# Altium schematic sheet Karduino_Sch.schdoc
size 287 x 176 mm
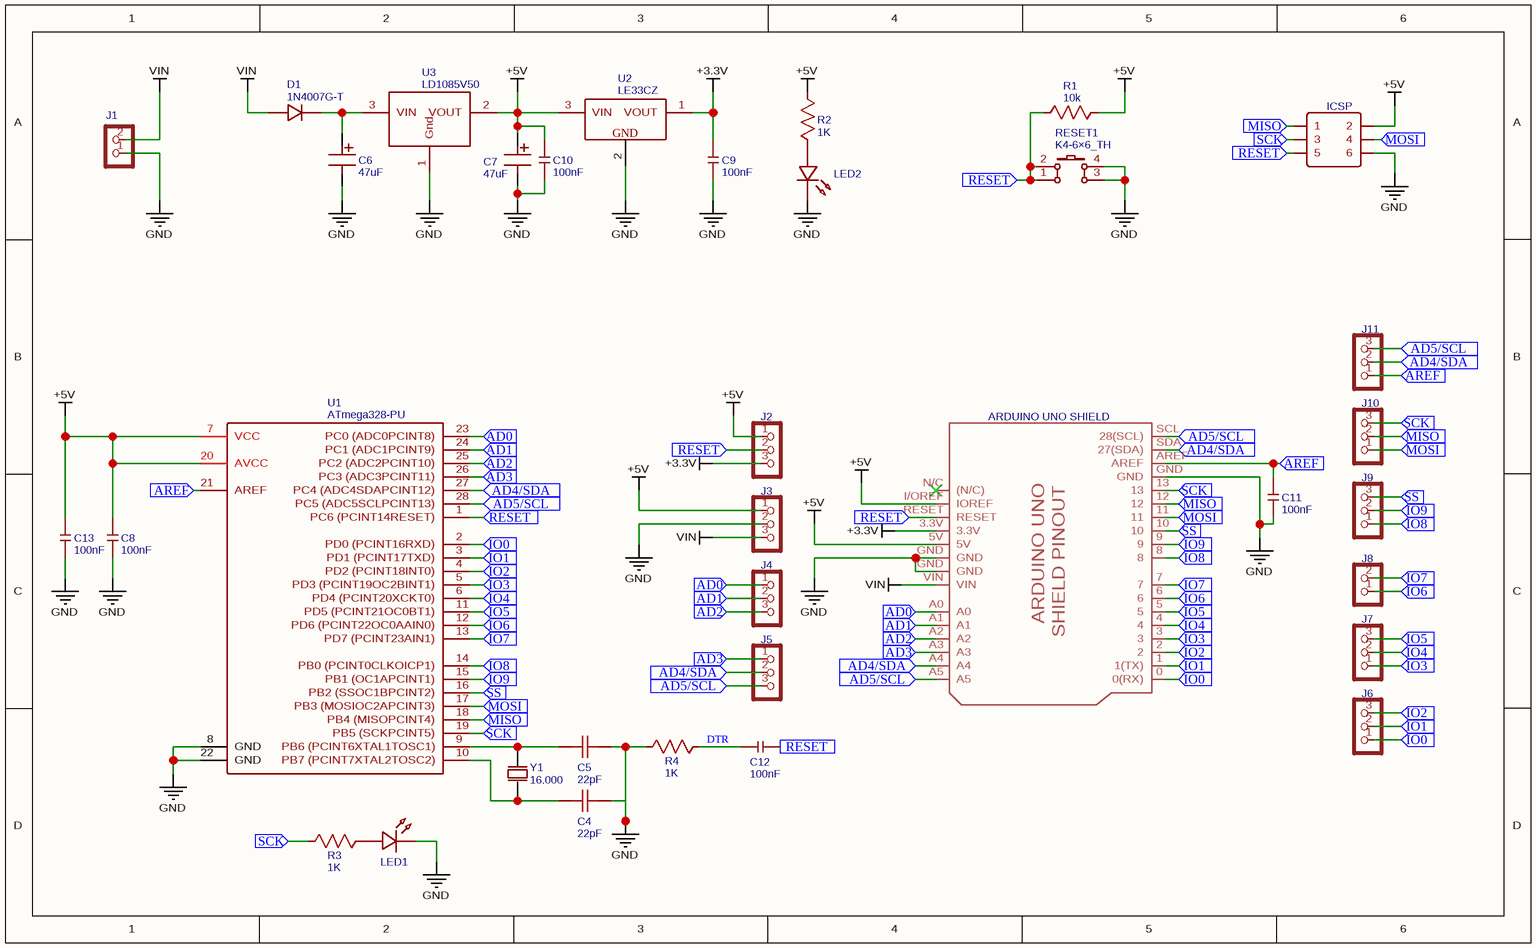
[diagram p0: Karduino_Sch.schdoc]

## Parts
C4  22pF  [CAP-TH_L4.8-W3.2-P5.08-D0.5]
C5  22pF  [CAP-TH_L4.8-W3.2-P5.08-D0.5]
C6  47uF  [PKG-ELE-CAP-D5.0XH11.0XF2.0-VERT]
C7  47uF  [PKG-ELE-CAP-D5.0XH11.0XF2.0-VERT]
C8  100nF  [100NF, 63V CAPACITOR]
C9  100nF  [100NF, 63V CAPACITOR]
C10  100nF  [100NF, 63V CAPACITOR]
C11  100nF  [100NF, 63V CAPACITOR]
C12  100nF  [100NF, 63V CAPACITOR]
C13  100nF  [100NF, 63V CAPACITOR]
D1  1N4007G-T  [DO-41_BD2.4-L4.7-P8.70-D0.9-RD]
ICSP  ICSP  [HDR-TH_6P-P2.54-V-M-R2-C3-S2.54-1]  (value not drawn)
J1  CON_TERMINAL_BLOCK_02-5MM  [TERMINAL_BLOCK_2P_5]  (value not drawn)
J2  CON_TERMINAL_BLOCK_03-5MM  [TERMINAL_BLOCK_3P_5]  (value not drawn)
J3  CON_TERMINAL_BLOCK_03-5MM  [TERMINAL_BLOCK_3P_5]  (value not drawn)
J4  CON_TERMINAL_BLOCK_03-5MM  [TERMINAL_BLOCK_3P_5]  (value not drawn)
J5  CON_TERMINAL_BLOCK_03-5MM  [TERMINAL_BLOCK_3P_5]  (value not drawn)
J6  CON_TERMINAL_BLOCK_03-5MM  [TERMINAL_BLOCK_3P_5]  (value not drawn)
J7  CON_TERMINAL_BLOCK_03-5MM  [TERMINAL_BLOCK_3P_5]  (value not drawn)
J8  CON_TERMINAL_BLOCK_02-5MM  [TERMINAL_BLOCK_2P_5]  (value not drawn)
J9  CON_TERMINAL_BLOCK_03-5MM  [TERMINAL_BLOCK_3P_5]  (value not drawn)
J10  CON_TERMINAL_BLOCK_03-5MM  [TERMINAL_BLOCK_3P_5]  (value not drawn)
J11  CON_TERMINAL_BLOCK_03-5MM  [TERMINAL_BLOCK_3P_5]  (value not drawn)
LED1  LED-TH-3mm_G  [LED-TH_BD3.0_GREEN]  (value not drawn)
LED2  LED-TH-3mm_R  [LED-TH_BD3.0_RED]  (value not drawn)
PCB1  ARDUINO UNO SHIELD  [E14_ARDUINO_SHIELD_PINOUT]
R1  10k  [R_AXIAL-0.3]
R2  1K  [R_AXIAL-0.3]
R3  1K  [R_AXIAL-0.3]
R4  1K  [R_AXIAL-0.3]
RESET1  K4-6×6_TH  [KEY-TH_4P-L6.0-W6.0-P4.50-LS6.5]
U1  ATmega328-PU  [DIP28]
U2  LE33CZ  [TO92-INLINE]
U3  LD1085V50  [TO_220 HEATSINK]
Y1  16.000  [CRYSTAL-TH_L10.8-W4.5-P4.88]

## Ports
AD0 (in), AD1 (in), AD2 (in), AD3 (in), AD4/SDA (in), AD5/SCL (in), AREF (in), IO0 (in), IO1 (in), IO2 (in), IO3 (in), IO4 (in), IO5 (in), IO6 (in), IO7 (in), IO8 (in), IO9 (in), MISO (in), MOSI (in), RESET (in), SCK (in), SS (in)

## Nets
+3.3V: C9.2 J2.3 PCB1.3.3V U2.1(VOUT)
+5V: C7.1 C8.2 C10.2 C13.2 ICSP.2 J2.1 J3.1 PCB1.5V PCB1.I/OREF(IOREF) R1.1 R2.2 U1.7(VCC) U1.20(AVCC) U2.3(VIN) U3.2(VOUT)
GND: C4.2 C5.2 C6.2 C7.2 C8.1 C9.1 C10.1 C11.1 C13.1 ICSP.6 J1.1 J3.2 LED1.2 LED2.2 PCB1.GND R4.1 RESET1.3 RESET1.4 U1.8(GND) U1.22(GND) U2.2(GND) U3.1(Gnd)
VIN: D1.2(A) J1.2 J3.3 PCB1.VIN
AD0: J4.1 PCB1.A0 U1.23(PC0_(ADC0PCINT8)) ; port AD0
AD1: J4.2 PCB1.A1 U1.24(PC1_(ADC1PCINT9)) ; port AD1
AD2: J4.3 PCB1.A2 U1.25(PC2_(ADC2PCINT10)) ; port AD2
AD3: J5.1 PCB1.A3 U1.26(PC3_(ADC3PCINT11)) ; port AD3
AD4/SDA: J5.2 J11.2 PCB1.A4 PCB1.SDA(27(SDA)) U1.27(PC4_(ADC4SDAPCINT12)) ; port AD4/SDA
AD5/SCL: J5.3 J11.3 PCB1.A5 PCB1.SCL(28(SCL)) U1.28(PC5_(ADC5SCLPCINT13)) ; port AD5/SCL
AREF: C11.2 J11.1 PCB1.AREF U1.21(AREF) ; port AREF
DTR: C12.1 R4.2
IO0: J6.1 PCB1.0(0(RX)) U1.2(PD0_(PCINT16RXD)) ; port IO0
IO1: J6.2 PCB1.1(1(TX)) U1.3(PD1_(PCINT17TXD)) ; port IO1
IO2: J6.3 PCB1.2 U1.4(PD2_(PCINT18INT0)) ; port IO2
IO3: J7.1 PCB1.3 U1.5(PD3_(PCINT19OC2BINT1)) ; port IO3
IO4: J7.2 PCB1.4 U1.6(PD4_(PCINT20XCKT0)) ; port IO4
IO5: J7.3 PCB1.5 U1.11(PD5_(PCINT21OC0BT1)) ; port IO5
IO6: J8.1 PCB1.6 U1.12(PD6_(PCINT22OC0AAIN0)) ; port IO6
IO7: J8.2 PCB1.7 U1.13(PD7_(PCINT23AIN1)) ; port IO7
IO8: J9.1 PCB1.8 U1.14(PB0_(PCINT0CLKOICP1)) ; port IO8
IO9: J9.2 PCB1.9 U1.15(PB1_(OC1APCINT1)) ; port IO9
MISO: ICSP.1 J10.2 PCB1.12 U1.18(PB4_(MISOPCINT4)) ; port MISO
MOSI: ICSP.4 J10.1 PCB1.11 U1.17(PB3_(MOSIOC2APCINT3)) ; port MOSI
RESET: C12.2 ICSP.5 J2.2 PCB1.RESET R1.2 RESET1.1 RESET1.2 U1.1(PC6_(PCINT14RESET)) ; port RESET
SCK: ICSP.3 J10.3 PCB1.13 R3.1 U1.19(PB5_(SCKPCINT5)) ; port SCK
SS: J9.3 PCB1.10 U1.16(PB2_(SSOC1BPCINT2)) ; port SS
NetC4_1: C4.1 U1.10(PB7_(PCINT7XTAL2TOSC2)) Y1.1
NetC5_1: C5.1 U1.9(PB6_(PCINT6XTAL1TOSC1)) Y1.2
NetC6_1: C6.1 D1.1(K) U3.3(VIN)
NetLED1_1: LED1.1 R3.2
NetLED2_1: LED2.1 R2.1

Not connected (* = marked no-connect by the designer): PCB1 N/C((N/C))*

## Notes on the sheet
- (in symbol ARDUINO UNO SHIELD) ARDUINO UNO; SHIELD PINOUT

## Library data of the parts
C4 C5 = 22pF: Manufacturer: TORCH(火炬); Manufacturer Part: CC4-0805-CG-50V-22pF-J; nameAlias: Capacitance; Contributor: LCSC; Supplier: LCSC; Supplier Part: C123150; JLCPCB Part Class: Extended Part; spicePre: C; spiceSymbolName: CC4-0805-CG -50V-22pF-J
C6 C7 = 47uF: Manufacturer: MULTICOMP; Manufacturer Part: MCGPR25V476M5X11; nameAlias: Value; Voltage: 25V; Tolerance: ±20%; Contributor: Prof. Ing. F. Scordino; Height: 11mm; Supplier Part: 9451170; Supplier: Element14; link: http://www.farnell.com/datasheets/1723232.pdf?_ga=2.112623111.2092337166.1543251338-1293072918.1542215968&_gac=1.229245224.1543251338.EAIaIQobChMIkZrTnMPy3gIVECjTCh1O3QY_EAAYASAAEgL_ivD_BwE; spicePre: C; spiceSymbolName: MCGPR25V476M5X11
C8-C13 = 100nF: description: 302010208; Contributor: pitpossum 79; spicePre: C; spiceSymbolName: 100NF,_63V_CAPACITOR
D1 = 1N4007G-T: Manufacturer: Diodes Incorporated; Contributor: Habetamu Gezachew; SMT Type: Extend; Supplier: LCSC; Supplier Part: C516593; Manufacturer Part: 1N4007G-T; LCSC Assembly: Yes; spicePre: D; spiceSymbolName: 1N4007G-T
ICSP = ICSP: Manufacturer: BOOMELE(博穆精密); Manufacturer Part: 2.54-2*3P针; Supplier: LCSC; Supplier Part: C65114; JLCPCB Part Class: Extended Part; spicePre: J; spiceSymbolName: Header-Male-2.54_2x3
J1 J8 = CON_TERMINAL_BLOCK_02-5MM: description: 2 poles wire to board terminal block; Contributor: DangerousPrototype; spicePre: J; spiceSymbolName: CON_TERMINAL_BLOCK_02-5MM
J2-J7 J9-J11 = CON_TERMINAL_BLOCK_03-5MM: description: 3 poles, wire to board connector; Contributor: DangerousPrototype; spicePre: J; spiceSymbolName: CON_TERMINAL_BLOCK_03-5MM
LED1 = LED-TH-3mm_G: Manufacturer: EVERLIGHT(台湾亿光); Manufacturer Part: 204-10SYGD/S530-E3; Contributor: LCEDA_Lib; Supplier Part: C85161; spicePre: L; spiceSymbolName: LED-TH-3mm_G
LED2 = LED-TH-3mm_R: Manufacturer: EVERLIGHT(台湾亿光); Manufacturer Part: 204-10SDRD/S530-A3-L; Contributor: LCEDA_Lib; Supplier Part: C84774; Supplier: LCSC; spicePre: L; spiceSymbolName: LED-TH-3mm_R
PCB1 = ARDUINO UNO SHIELD: Contributor: prodatasimulations; Supplier: Botland; spicePre: P; spiceSymbolName: ARDUINO UNO SHIELD
R1 = 10k: nameAlias: Value(Ω); Contributor: LCEDA_Lib; spicePre: R; spiceSymbolName: R_AXIAL-0.3_US
R2-R4 = 1K: nameAlias: Value(Ω); Contributor: LCEDA_Lib; spicePre: R; spiceSymbolName: R_AXIAL-0.3_US
RESET1 = K4-6×6_TH: Manufacturer: 韩国韩荣; Manufacturer Part: K2-1102DP-E4SW-04; Contributor: LCEDA_Lib; Supplier: LCSC; Supplier Part: C136684; spicePre: K; spiceSymbolName: K4-6×6_TH
U1 = ATmega328-PU: description: 8-bit AVR Microcontroller, 32KB Flash, 1KB EEPROM, 2KB SRAM, 28-pin PDIP, Industrial Grade (-40u7648 to 85u7648); spicePre: U; spiceSymbolName: ATmega328-PU
U2 = LE33CZ: description: Very Low Drop Voltage Regulators with Inhibit, 3.3V, 3-Pin TO92-INLINE, Tape and Reel; spicePre: U; spiceSymbolName: LE33CZ
U3 = LD1085V50: Manufacturer: STMicroelectronics; Contributor: ih55t; Supplier: Mouser; Manufacturer Part: LD1085V50; Supplier Part: 511-LD1085V50; JLCPCB Part Class: Extended Part; link: https://www.mouser.com/ProductDetail/511-LD1085V50; spicePre: U; spiceSymbolName: LD1085V50
Y1 = 16.000: Manufacturer: CTS(西迪斯); Manufacturer Part: ATS098; Contributor: lcsc; nameAlias: Frequency; Supplier: LCSC; Supplier Part: C1669760; link: https://atta.szlcsc.com/upload/public/pdf/source/20200318/C487700_6E42144C1E843ECF848E205586EC895F.pdf; JLCPCB Part Class: Extended Part; spicePre: U; spiceSymbolName: ATS098